# EasyEDA Pro project receiver by chandan.eprj

# Schematic Reciever
Board Name: Reciever; Create Date: 2025-07-13; Page Name: Sheet_1; Project Name: receiver by chandan; Schematic Name: Reciever; Update Date: 2025-07-13; Add into BOM: yes; Company: Your Company; Convert to PCB: yes; Date: 2025-10-25; Draw By: chandan; REV: 1.0; Sheet: 1/1; spicePre: .
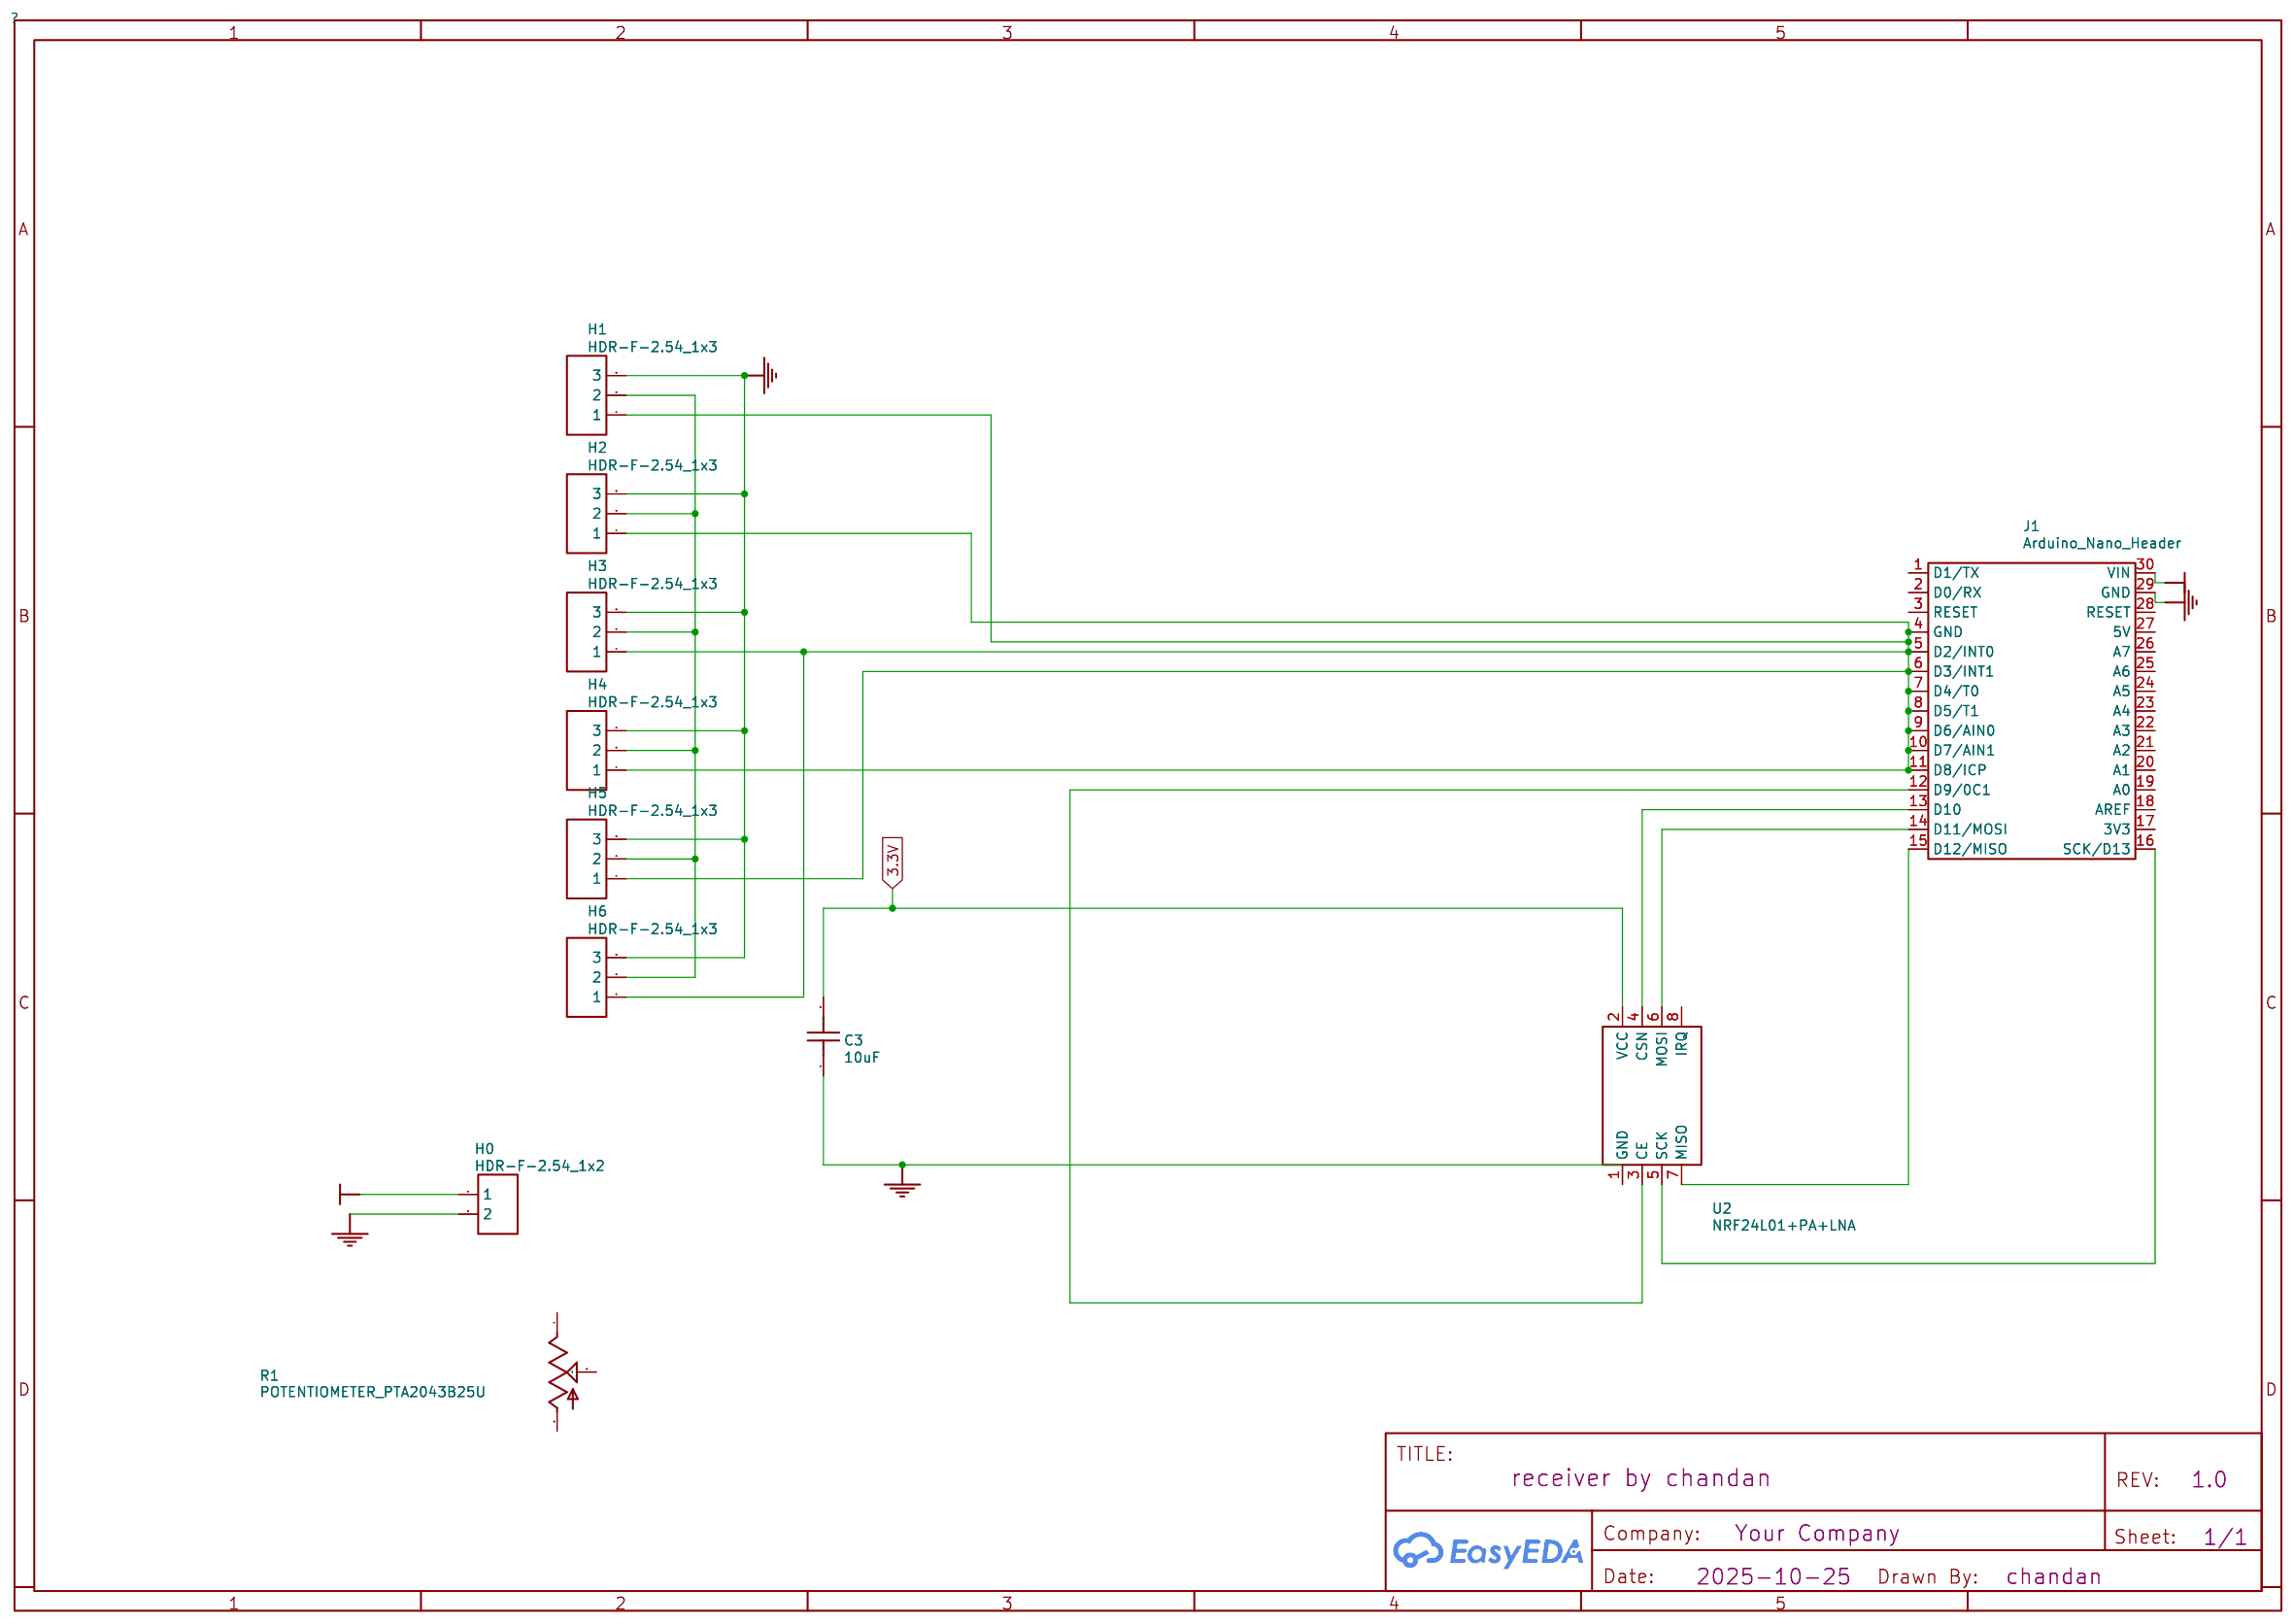
[diagram p0: schematic sheet]

## Parts
C3  10uF
H0  HDR-F-2.54_1x2
H1  HDR-F-2.54_1x3
H2  HDR-F-2.54_1x3
H3  HDR-F-2.54_1x3
H4  HDR-F-2.54_1x3
H5  HDR-F-2.54_1x3
H6  HDR-F-2.54_1x3
J1  Arduino_Nano_Header
R1  POTENTIOMETER_PTA2043B25U
U2  NRF24L01+PA+LNA

## Library data of the parts
C3 = 10uF: Supplier: LCSC; Supplier Part: C3694130; Manufacturer: TDK; Manufacturer Part: FK16X5R1H105K; Contributor: lcsc; nameAlias: Value; spicePre: C; spiceSymbolName: FK16X5R1H105K
H0 = HDR-F-2.54_1x2: Supplier Part: C49661; Supplier: LCSC; Contributor: LCEDA_Lib; spicePre: H
H1-H6 = HDR-F-2.54_1x3: Supplier Part: C146690; Supplier: LCSC; Contributor: LCEDA_Lib; spicePre: H
J1 = Arduino_Nano_Header: spicePre: J
R1 = POTENTIOMETER_PTA2043B25U: Contributor: mymindstorm; spicePre: R
U2 = NRF24L01+PA+LNA: Supplier: LCSC; Supplier Part: C9900187674; Manufacturer: null; Manufacturer Part: nRF24L01+PA+LNA; JLCPCB Part Class: Extended Part; Contributor: lcsc; spicePre: U

## Nets
3.3V: C3.2 U2.2(VCC)
+5V: H0.1 J1.30(VIN)
GND: C3.1 H0.2 H1.3 H2.3 H3.3 H4.3 H5.3 H6.3 J1.29(GND) U2.1(GND)
Net-(H1-1): H1.1 H2.1 H3.1 H4.1 H5.1 H6.1 J1.4(GND) J1.5(D2/INT0) J1.6(D3/INT1) J1.7(D4/T0) J1.8(D5/T1) J1.9(D6/AIN0) J1.10(D7/AIN1) J1.11(D8/ICP)
Net-(H1-2): H1.2 H2.2 H3.2 H4.2 H5.2 H6.2
Net-(J1-12): J1.12(D9/0C1) U2.3(CE)
Net-(J1-13): J1.13(D10) U2.4(CSN)
Net-(J1-14): J1.14(D11/MOSI) U2.6(MOSI)
Net-(J1-15): J1.15(D12/MISO) U2.7(MISO)
Net-(J1-16): J1.16(SCK/D13) U2.5(SCK)

Not connected (* = marked no-connect by the designer): J1 1(D1/TX) 2(D0/RX) 3(RESET) 17(3V3) 18(AREF) 19(A0) 20(A1) 21(A2) 22(A3) 23(A4) 24(A5) 25(A6) 26(A7) 27(5V) 28(RESET); R1 1(E) 2(S) 3(A); U2 8(IRQ)

# Board receiver by chandan
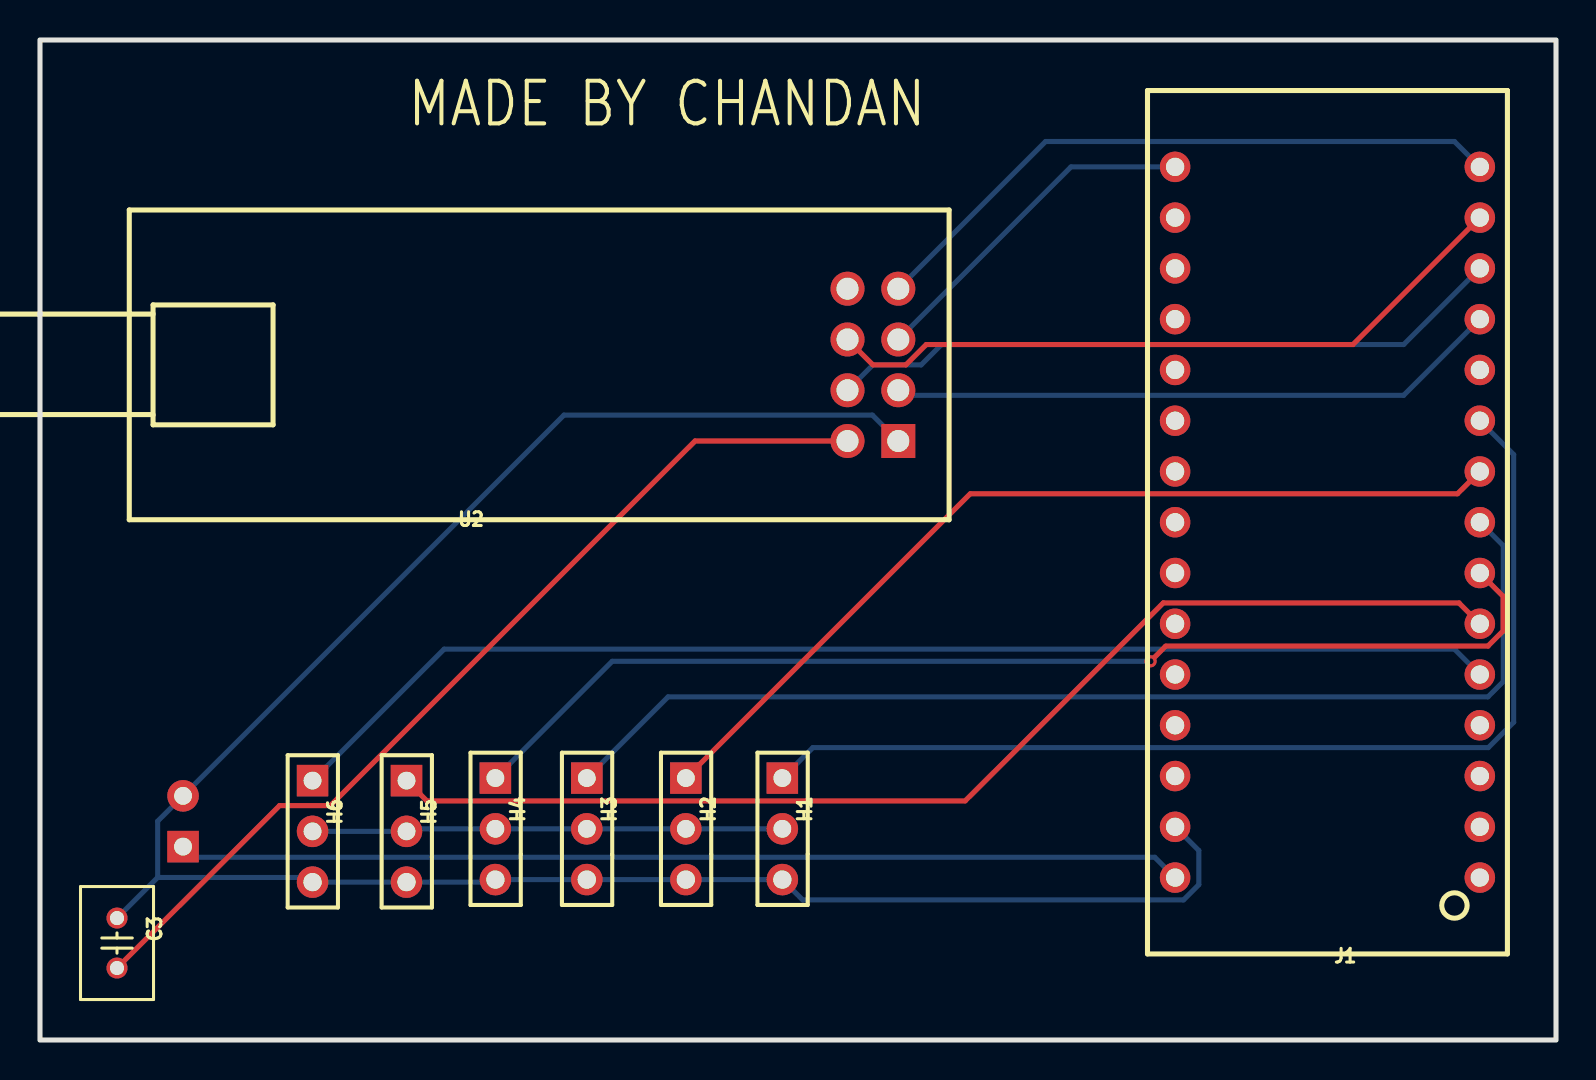
[diagram p1: board, top side]
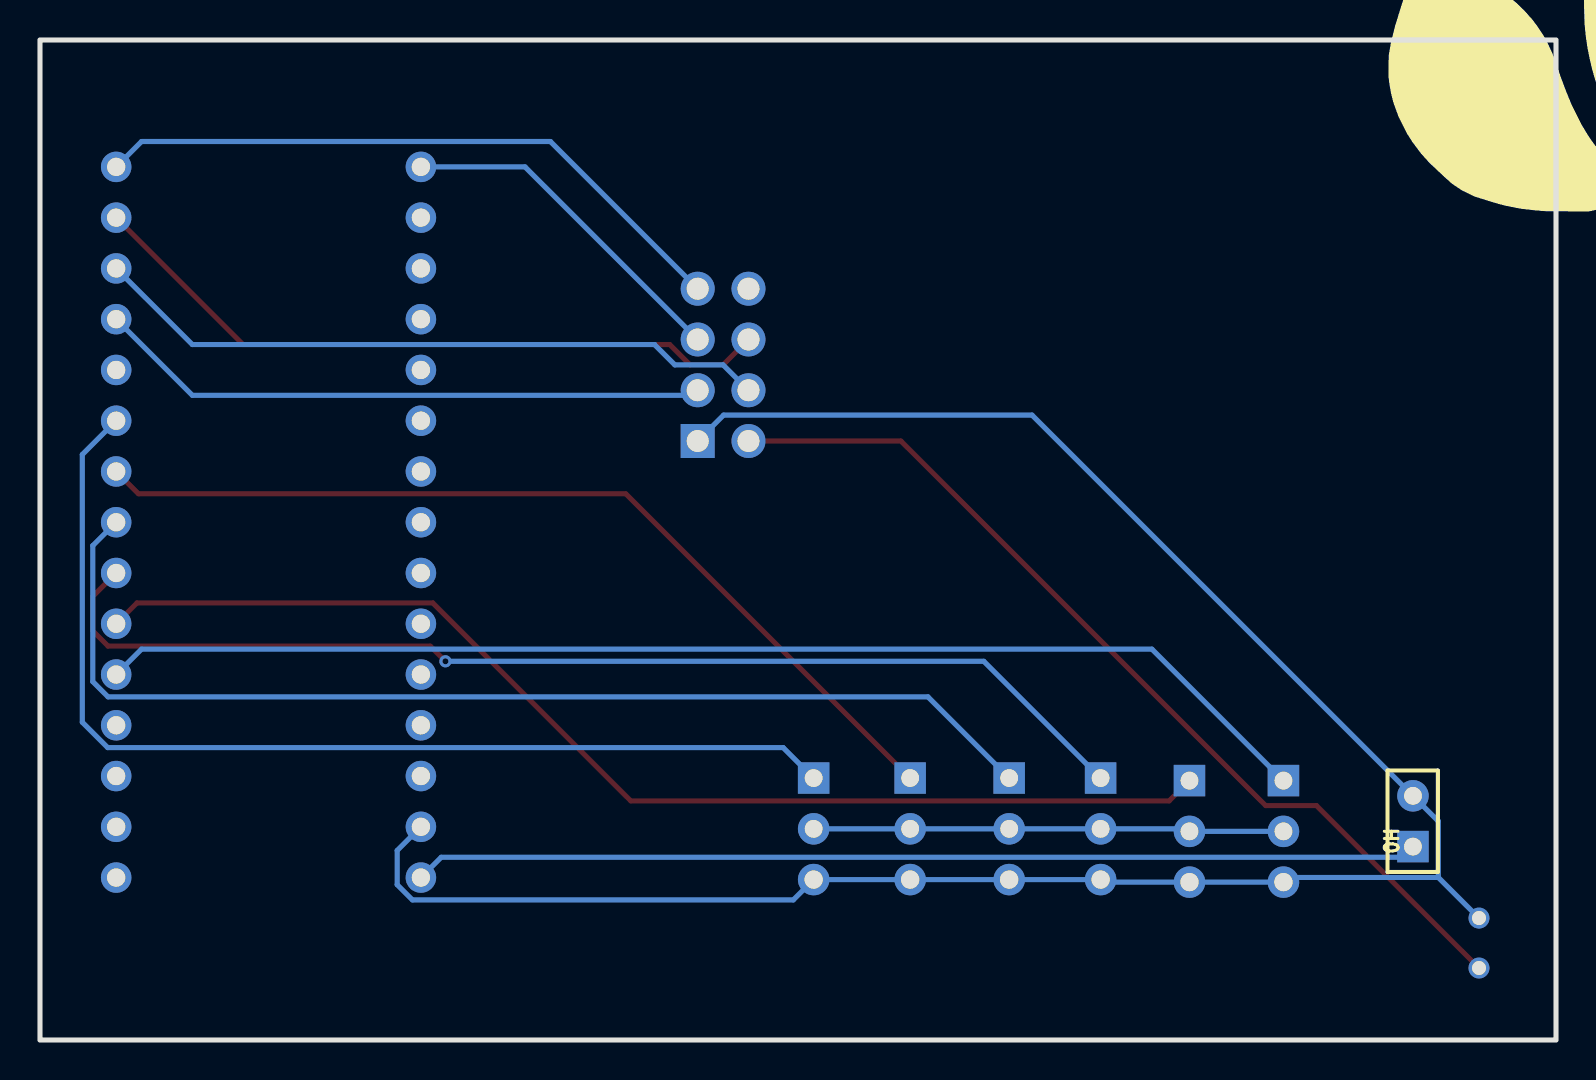
[diagram p2: board, bottom side, seen from below]

Outline 75.82 x 50.04 mm; copper layers: Top Layer, Bottom Layer. Coordinates in mm from the lower left corner of the outline.
Outline path: rectangle 0,50.04 75.82,0
Stack: Top Layer 0.035mm / Dielectric1 1.51mm FR4 er 4.5 / Bottom Layer 0.035mm

## Design rules (mm)
spacing Default (default): track to track 0.152, other pairs 0 to 0.152
track width Default (default): min 0.254, default 0.254, max 25.4
differential pair differentialPair (default): width min 0.127, default 0.254, max 2.54; gap min 0.152, default 0.152
via Default (default): diameter min 0.61, default 0.61, max 100.025; hole min 0.305, default 0.305, max 59.995

## Placement (name value [footprint] x y rotation side)
C3  10uF  [CAP-TH_L5.5-W3.5-P2.50-D0.5]  3.85 4.85 270 top
H0  HDR-F-2.54_1x2  [HDR-F-2.54_1X2]  7.15 10.95 90 bottom
H1  HDR-F-2.54_1x3  [HDR-F-2.54_1X3]  37.13 10.57 270 top
H2  HDR-F-2.54_1x3  [HDR-F-2.54_1X3]  32.3 10.57 270 top
H3  HDR-F-2.54_1x3  [HDR-F-2.54_1X3]  27.35 10.57 270 top
H4  HDR-F-2.54_1x3  [HDR-F-2.54_1X3]  22.78 10.57 270 top
H5  HDR-F-2.54_1x3  [HDR-F-2.54_1X3]  18.33 10.44 270 top
H6  HDR-F-2.54_1x3  [HDR-F-2.54_1X3]  13.63 10.44 270 top
J1  Arduino_Nano_Header  [DIP-30_L43.18-W15.24-ARDUINONANO]  64.39 25.91 180 top
U2  NRF24L01+PA+LNA  [COMM-TH_L41.0-W15.5-P2.54_NRF24L01]  41.66 33.78 180 top

## Footprints (pads in the part's own frame, mm; a bottom-side part is the same pattern mirrored in y, then rotated)
CAP-TH_L5.5-W3.5-P2.50-D0.5
  round 1.05 hole 0.7: 1(-1.25,0) 2(1.25,0)
COMM-TH_L41.0-W15.5-P2.54_NRF24L01
  rect 1.7x1.7 hole 1.1: 1(-1.27,3.81)
  round 1.7 hole 1.1: 2(1.27,3.81) 3(-1.27,1.27) 4(1.27,1.27) 5(-1.27,-1.27) 6(1.27,-1.27) 7(-1.27,-3.81) 8(1.27,-3.81)
DIP-30_L43.18-W15.24-ARDUINONANO
  round 1.524 hole 0.914: 1(-7.62,17.78) 2(-7.62,15.24) 3(-7.62,12.7) 4(-7.62,10.16) 5(-7.62,7.62) 6(-7.62,5.08) 7(-7.62,2.54) 8(-7.62,0) 9(-7.62,-2.54) 10(-7.62,-5.08) 11(-7.62,-7.62) 12(-7.62,-10.16) 13(-7.62,-12.7) 14(-7.62,-15.24) 15(-7.62,-17.78) 16(7.62,-17.78) 17(7.62,-15.24) 18(7.62,-12.7) 19(7.62,-10.16) 20(7.62,-7.62) 21(7.62,-5.08) 22(7.62,-2.54) 23(7.62,0) 24(7.62,2.54) 25(7.62,5.08) 26(7.62,7.62) 27(7.62,10.16) 28(7.62,12.7) 29(7.62,15.24) 30(7.62,17.78)
HDR-F-2.54_1X2
  rect 1.575x1.575 hole 0.889: 1(-1.27,0)
  round 1.575 hole 0.889: 2(1.27,0)
HDR-F-2.54_1X3
  rect 1.575x1.575 hole 0.889: 1(-2.54,0)
  round 1.575 hole 0.889: 2(0,0)
  round 1.575 hole 0.914: 3(2.54,0)

## Nets
3.3V: C3.2 U2.2
+5V: H0.1 J1.30
GND: C3.1 H0.2 H1.3 H2.3 H3.3 H4.3 H5.3 H6.3 J1.29 U2.1
H2_2: H1.2 H2.2 H3.2 H4.2 H5.2 H6.2
J1_1: J1.1
J1_2: J1.2
J1_3: J1.3
J1_4: J1.4
J1_5: H6.1 J1.5
J1_6: H5.1 J1.6
J1_7: H4.1 J1.7
J1_8: H3.1 J1.8
J1_9: H2.1 J1.9
J1_10: H1.1 J1.10
J1_11: J1.11
J1_17: J1.17
J1_18: J1.18
J1_19: J1.19
J1_20: J1.20
J1_21: J1.21
J1_22: J1.22
J1_23: J1.23
J1_24: J1.24
J1_25: J1.25
J1_26: J1.26
J1_27: J1.27
J1_28: J1.28
U2_3: J1.12 U2.3
U2_4: J1.13 U2.4
U2_5: J1.16 U2.5
U2_6: J1.14 U2.6
U2_7: J1.15 U2.7
U2_8: U2.8

## Via types
v1: diameter 0.61, hole 0.305, Top Layer to Bottom Layer, 1 via

## Routing (per net, layer and track width the routed paths; a pad name or vN(x,y) marks a point on that pad's centre or on a via; arc(x,y) is an arc through that point)
3.3V: length 47.5
  Top Layer w0.254: U2.2 32.76,29.97 14.52,11.73 11.98,11.73 C3.2
+5V: length 50.3
  Bottom Layer w0.254: J1.30 55.75,9.14 7.69,9.14 H0.1
GND: length 108
  Bottom Layer w0.254: C3.1 5.88,8.13 ; 5.88,8.13 13.4,8.13 H6.3 H5.3 22.65,7.9 H4.3 H3.3 H2.3 H1.3 38.14,7.01 57.19,7.01 57.95,7.77 57.95,9.48 J1.29 ; 5.88,8.13 5.88,10.95 H0.2 26.2,31.27 41.63,31.27 U2.1
H2_2: length 23.5
  Bottom Layer w0.254: H1.2 H2.2 H3.2 H4.2 18.46,10.57 H5.2 H6.2
J1_5: length 61.6
  Bottom Layer w0.254: J1.5 70.74,19.56 20.21,19.56 H6.1
J1_6: length 58.6
  Top Layer w0.254: H5.1 19.35,11.96 46.27,11.96 56.18,21.87 70.97,21.87 J1.6
J1_7: length 56.8
  Top Layer w0.254: J1.7 73.18,22.2 73.18,20.47 72.42,19.71 56.3,19.71 v1(55.54,18.95)
  Bottom Layer w0.254: v1(55.54,18.95) 28.62,18.95 H4.1
J1_8: length 56.3
  Bottom Layer w0.254: J1.8 73.18,24.74 73.18,17.93 72.42,17.17 31.41,17.17 H3.1
J1_9: length 46.1
  Top Layer w0.254: H2.1 46.52,27.33 70.89,27.33 J1.9
J1_10: length 53.5
  Bottom Layer w0.254: H1.1 38.65,14.63 72.43,14.63 73.7,15.9 73.7,29.29 J1.10
U2_3: length 30.8
  Bottom Layer w0.254: U2.3 43.18,32.26 68.2,32.26 J1.12
U2_4: length 34.1
  Bottom Layer w0.254: U2.4 41.66,33.78 44.07,33.78 45.09,34.8 68.2,34.8 J1.13
U2_5: length 17.4
  Bottom Layer w0.254: U2.5 51.56,43.69 J1.16
U2_6: length 35.2
  Top Layer w0.254: U2.6 41.66,33.78 43.31,33.78 44.32,34.8 65.66,34.8 J1.14
U2_7: length 32.7
  Bottom Layer w0.254: U2.7 50.29,44.96 70.74,44.96 J1.15

## Text on the board
Top Silkscreen Layer: MADE BY CHANDAN
